# Altium schematic sheet TOP24x_24V_FLYBACK.SchDoc
size A4
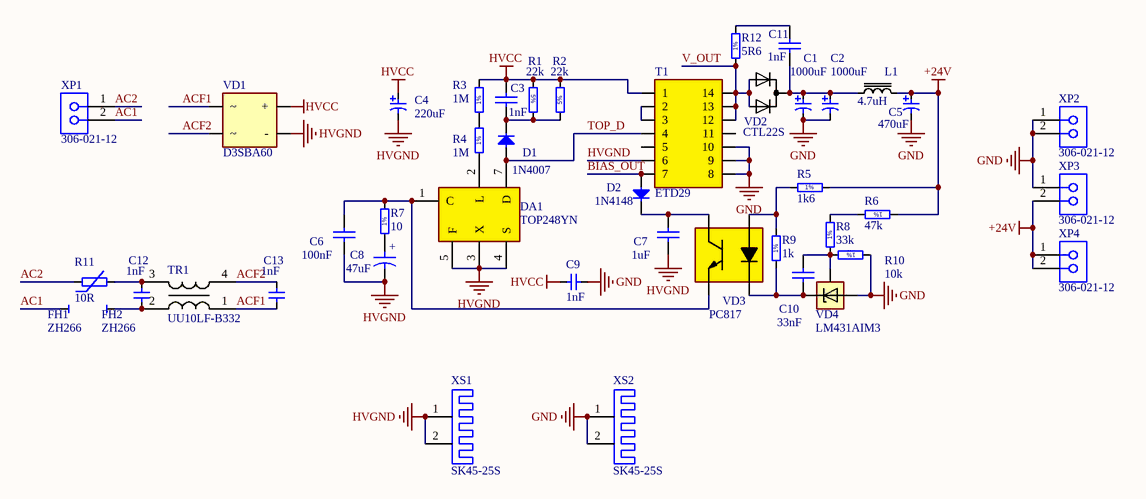
[diagram p0: TOP24x_24V_FLYBACK.SchDoc]

## Parts
C1  1000uF  [CAP_EL_13_20_VERT]
C2  1000uF  [CAP_EL_13_20_VERT]
C3  1nF  [CAPR500-250X720X650]
C4  220uF  [CAP_EL_25_40_VERT]
C5  470uF  [CAP_EL_10_19_VERT]
C6  100nF  [CAPRR508-350X500X500]
C7  1uF  [CAPRR508-508X762X914]
C8  47uF  [CAPPR350-800X1150]
C9  1nF  [CAP_7.5MM_Y]
C10  33nF  [CAPRR254-318X508X660]
C11  1nF  [CAPR500-250X720X650]
C12  1nF  [CAP_7.5MM_Y]
C13  1nF  [CAP_7.5MM_Y]
D1  1N4007  [DO-41]
D2  1N4148  [DO-35]
DA1  TOP248YN  [TO-220-7]
FH1  ZH266  [ZH266]
FH2  ZH266  [ZH266]
L1  4.7uH  [SL1016]
R1  22k  [RESADV508-1670X520]
R2  22k  [RESADV508-1670X520]
R3  1M  [RES_AXIAL_0_25_8]
R4  1M  [RES_AXIAL_0_25_8]
R5  1k6  [RES_AXIAL_0_25_8]
R6  47k  [RES_AXIAL_0_25_8]
R7  10  [RES_AXIAL_0_25_8]
R8  33k  [RES_AXIAL_0_25_8]
R9  1k  [RES_AXIAL_0_25_8]
R10  10k  [RES_AXIAL_0_25_8]
R11  10R  [B57164K]
R12  5R6  [RES_AXIAL_0_25_8]
T1  ETD29  [ETD29]
TR1  PartNumber: UU10LF-B332  [CG00008A]  (hidden comment: 22mH)
VD1  D3SBA60  [D3SBAXX]
VD2  CTL22S  [TO-220-3]
VD3  PC817  [DIP4]
VD4  LM431AIM3  [TO92]
XP1  306-021-12  [306-021-12]
XP2  306-021-12  [306-021-12]
XP3  306-021-12  [306-021-12]
XP4  306-021-12  [306-021-12]
XS1  SK45-25S  [SK45-25S]
XS2  SK45-25S  [SK45-25S]

## Nets
+24V: C5.1 L1.2 R5.2 R6.1 XP3.2 XP4.1 XP4.2
GND: C1.2 C2.2 C5.2 C9.2 R10.1 T1.8 T1.9 T1.10 VD4.2(A) XP2.1 XP2.2 XP3.1 XS2.1(PIN) XS2.2(PIN)
HVCC: C3.2 C4.1 C9.1 R1.1 R2.2 R3.2 T1.1 VD1.P(+)
HVGND: C4.2 C6.2 C7.1 C8.2 DA1.3(X) DA1.4(S) DA1.5(F) T1.6 VD1.N(-) XS1.1(PIN) XS1.2(PIN)
AC1: FH1.1 XP1.2
AC2: R11.1 XP1.1
ACF1: C13.1 TR1.1 VD1.AC1
ACF2: C13.2 TR1.4 VD1.AC2
BIAS_OUT: D2.2(A) T1.7
TOP_D: D1.2(A) DA1.7(D) T1.4
V_OUT: R12.1 T1.12 T1.13 T1.14 VD2.1(A) VD2.3(A)
NetC1_1: C1.1 C2.1 C11.1 L1.1 VD2.2(K)
NetC3_1: C3.1 D1.1(C) R1.2 R2.1
NetC6_1: C6.1 DA1.1(C) R7.2 VD3.3(E)
NetC7_2: C7.2 D2.1(C) VD3.4(C)
NetC8_1: C8.1 R7.1
NetC10_1: C10.1 R8.1 R10.2 VD4.3(REF)
NetC10_2: C10.2 R9.1 VD3.2(K) VD4.1(K)
NetC11_2: C11.2 R12.2
NetC12_1: C12.1 FH2.1 TR1.2
NetC12_2: C12.2 R11.2 TR1.3
NetDA1_2: DA1.2(L) R4.1
NetR3_1: R3.1 R4.2
NetR5_1: R5.1 R9.2 VD3.1(A)
NetR6_2: R6.2 R8.2
NetT1_2: T1.2 T1.3

Not connected (* = marked no-connect by the designer): T1 5 11

## Notes on the sheet
- (in symbol CAER_47UF_63V_20%_350-800X1150) +
- (in symbol RMF_1K6_1%_0.6W_50PPM_1016-630X250) 1%
- (in symbol RMF_1K_1%_0.6W_50PPM_1016-630X250) 1%
- (in symbol RMF_1M_1%_0.6W_50PPM_1016-630X250) 1%
- (in symbol RMF_5R6_1%_0.6W_50PPM_1016-630X250) 1%
- (in symbol RMF_10K_1%_0.6W_50PPM_1016-630X250) 1%
- (in symbol RMF_10R_1%_0.6W_50PPM_1016-630X250) 1%
- (in symbol RMF_22K_5%_3W_250PPM_508-1670X520_v) 5%
- (in symbol RMF_33K_1%_0.6W_50PPM_1016-630X250) 1%
- (in symbol RMF_47K_1%_0.6W_50PPM_1016-630X250) 1%

## Library data of the parts
C1 C2 = SK035M1000B5S-1320 (VERT MOUNTED): Voltage: 35V; Table: Electrolytic THD; Part Number: SK035M1000B5S-1320 (VERT MOUNTED); Value: 1000uF
C3 C11 = CPER_1NF_63V_10%_500-250X720X650: Non-polarised capacitor; Part Description: Metallized Polyester Film Capacitor (MKT); Manufacturer: EPCOS; Manufacturer Part Number: B32529C0102K000; Voltage: 63VDC/40VAC; Tolerance: ±10%; Table: Capacitors THD; Part Number: CPER_1NF_63V_10%_500-250X720X650; Component Kind: Standard; Component Type: Standard; Pin Count: 2; Value: 1nF; Status: None; Case: LS5 W2.5 x L7.2 x H6.5; Mounted: Yes; Socket: No; SMD: No; ComponentHeight: 6.5mm; HelpURL: \\cern.ch\dfs\Applications\Altium\Datasheets\CPER_EPCOS_B32529.pdf; Author: CERN DEM JLC; CreateDate: 19.12.2007; LatestRevisionDate: 19.12.2007
C4 = LG400M0220BPF-2540 (VERT MOUNTED): Voltage: 400V; Table: Electrolytic THD; Part Number: LG400M0220BPF-2540 (VERT MOUNTED); Value: 220uF
C5 = SH050M0470B5S-1019 (VERT MOUNTED): Voltage: 50V; Table: Electrolytic THD; Part Number: SH050M0470B5S-1019 (VERT MOUNTED); Value: 470uF
C6 = CCR_100NF_50V_10%_X7R_508-350X500X500: Non-polarised capacitor; Part Description: Radial Lead Type Monolithic Ceramic Capacitor; Manufacturer: MURATA; Manufacturer Part Number: RPER71H104K2M1A03A; Voltage: 50VDC; TC: X7R; Tolerance: ±10%; Table: Capacitors THD; Part Number: CCR_100NF_50V_10%_X7R_508-350X500X500; Component Kind: Standard; Component Type: Standard; Pin Count: 2; Value: 100nF; Status: Preferred; Case: LS5.08 W3.5 x L5 x H5; Mounted: Yes; Socket: No; SMD: No; ComponentHeight: 5.0mm; HelpURL: \\cern.ch\dfs\Applications\Altium\Datasheets\CCR_MURATA_RPE.pdf; Author: CERN DEM JLC; CreateDate: 28.01.2008; LatestRevisionDate: 24.08.2009
C7 = CCR_1UF_50V_10%_X7R_508-508X762X914: Non-polarised capacitor; Part Description: Radial Lead Type Multilayer Ceramic Capacitor; Manufacturer: KEMET; Manufacturer Part Number: C330C105K5R5TA; Voltage: 50VDC; TC: X7R; Tolerance: ±10%; Table: Capacitors THD; Part Number: CCR_1UF_50V_10%_X7R_508-508X762X914; Component Kind: Standard; Component Type: Standard; Pin Count: 2; Value: 1uF; Status: Preferred; Case: LS5.08 W5.08 x L7.62 x H9.14; Mounted: Yes; Socket: No; SMD: No; ComponentHeight: 9.14mm; HelpURL: \\cern.ch\dfs\Applications\Altium\Datasheets\CCR_KEMET_C330.pdf; Author: CERN DEM JLC; CreateDate: 28.01.2008; LatestRevisionDate: 28.01.2008
C8 = CAER_47UF_63V_20%_350-800X1150: Polarised capacitor; Part Description: Aluminum Electrolytic Capacitor; Manufacturer: GENERIC; Manufacturer1 Part Number: EEUFC1J470; Voltage: 63V; Tolerance: ±20%; Table: Capacitors THD; Part Number: CAER_47UF_63V_20%_350-800X1150; Component Kind: Standard; Component Type: Standard; Pin Count: 2; Value: 47uF; Status: Preferred; Manufacturer Part Number: CAER_47UF_63V_20%_350-800X1150; Case: LS3.5 D8 x H11.5; Mounted: Yes; Socket: No; SMD: No; ComponentHeight: 11.5mm; Manufacturer1 Example: PANASONIC; Manufacturer1 ComponentHeight: 11.5mm; HelpURL: \\cern.ch\dfs\Applications\Altium\Datasheets\CAER_PANASONIC_FC.pdf; Author: CERN DEM JLC; CreateDate: 18.12.2007; LatestRevisionDate: 18.12.2007
C9 C12 C13 = VKO102KCQTC0KR: SMD 0805 Capacitor; Voltage: 1000V; Tolerance: ±10%; Table: Ceramic THD; Part Number: VKO102KCQTC0KR; Value: 1nF
C10 = CCR_33NF_100V_10%_X7R_254-318X508X660: Non-polarised capacitor; Part Description: Radial Lead Type Multilayer Ceramic Capacitor; Manufacturer: GENERIC; Manufacturer1 Part Number: SR201C333KTR; Voltage: 100VDC; TC: X7R; Tolerance: ±10%; Table: Capacitors THD; Part Number: CCR_33NF_100V_10%_X7R_254-318X508X660; Component Kind: Standard; Component Type: Standard; Pin Count: 2; Value: 33nF; Status: Preferred; Manufacturer Part Number: CCR_33NF_100V_10%_X7R_254-318X508X660; Case: LS2.54 W3.18 x L5.08 x H6.6; Mounted: Yes; Socket: No; SMD: No; ComponentHeight: 6.6mm; Manufacturer1 Example: AVX; Manufacturer1 ComponentHeight: 6.6mm; HelpURL: \\cern.ch\dfs\Applications\Altium\Datasheets\CCR_AVX_SR20.pdf; Author: CERN DEM JLC; CreateDate: 30.01.2008; LatestRevisionDate: 24.08.2009
D1 = 1N4007: Diode; Part Description: Axial Lead Standard Recovery Rectifier; Manufacturer: FAIRCHILD SEMICONDUCTOR; Voltage: 1000V; Power: 1A; Table: Diodes; Part Number: 1N4007; Component Kind: Standard; Component Type: Standard; Device: 1N4007; PackageDescription: DO-41, Diode, Axial, Body 4.7 x 2.7mm (LxDia. Max), Pin spacing 10.16mm; Manufacturer Part Number: 1N4007; Pin Count: 2; Case: DO-41; Mounted: Yes; Socket: No; SMD: No; ComponentHeight: 2.72mm; HelpURL: \\cern.ch\dfs\Applications\Altium\Datasheets\1N4007.pdf; ComponentLink1URL: \\cern.ch\dfs\Applications\Altium\Datasheets\1N4007_Package.pdf; ComponentLink1Description: Package Drawing; Author: CERN DEM JLC; CreateDate: 20.08.2008; LatestRevisionDate: 30.10.2013
D2 = 1N4148: Diode; Part Description: High-Speed Diode; Manufacturer: NXP SEMICONDUCTORS; Voltage: 100V; Power: 200mA; Table: Diodes; Part Number: 1N4148; Component Kind: Standard; Component Type: Standard; Device: 1N4148; PackageDescription: DO-35, Diode, Axial, Body 4.6 x 2mm (LxDia. max), Pin spacing 7.62mm; Manufacturer Part Number: 1N4148; Pin Count: 2; Case: DO-35; Mounted: Yes; Socket: No; SMD: No; ComponentHeight: 1.85mm; HelpURL: \\cern.ch\dfs\Applications\Altium\Datasheets\1N4148.pdf; Author: CERN DEM JLC; CreateDate: 24.05.2012; LatestRevisionDate: 24.05.2012
DA1 = TOP248YN: Table: Power; Part Number: TOP248YN; Device: TOP248YN
FH1 FH2 = ZH266: Table: OTHER; Part Number: ZH266; Family: ZH266; Device: ZH266
L1 = SL1016T-4R7K-B-N: Table: Inductors THD; Tolerance: ± 10%; Part Number: SL1016T-4R7K-B-N; Value: 4.7uH
R1 R2 = RMF_22K_5%_3W_250PPM_508-1670X520_v: Resistor - 5%; Part Description: Leaded Power Metal Film Resistor (Vertical Mount) PR03 Series; Manufacturer: GENERIC; Manufacturer1 Part Number: PR03000202202JAC00; Power: 3W; TC: ±250ppm/°C; Table: Resistors THD; Part Number: RMF_22K_5%_3W_250PPM_508-1670X520_v; Component Kind: Standard; Component Type: Standard; Pin Count: 2; Value: 22k; Status: Preferred; Tolerance: ±5%; Manufacturer Part Number: RMF_22K_5%_3W_250PPM_508-1670X520; Case: LS5.08 L16.7 x D5.2; Mounted: Yes; Socket: No; SMD: No; ComponentHeight: 23.6mm; Manufacturer1 Example: VISHAY BCCOMPONENT; Manufacturer1 ComponentHeight: 23.6mm; HelpURL: \\cern.ch\dfs\Applications\Altium\Datasheets\RMF_VISHAY_PR03.pdf; Author: CERN DEM JLC; CreateDate: 18.11.2011; LatestRevisionDate: 01.10.2012
R3 R4 = RMF_1M_1%_0.6W_50PPM_1016-630X250: Part Description: Leaded Metal Film Resistor; Manufacturer: GENERIC; Manufacturer1 Part Number: MBB02070C1004FCT00; Power: 0.6W; TC: ±50ppm/°C; Tolerance: ±1%; Table: THD; Part Number: RMF_1M_1%_0.6W_50PPM_1016-630X250; Component Kind: Standard; Component Type: Standard; Pin Count: 2; Value: 1M; Status: Preferred; Manufacturer Part Number: RMF_1M_1%_0.6W_50PPM_1016-630X250; Case: LS10.16 L6.3 x D2.5; Mounted: Yes; Socket: No; SMD: No; ComponentHeight: 2.5mm; Manufacturer1 Example: VISHAY BEYSCHLAG; Manufacturer1 ComponentHeight: 2.5mm; HelpURL: \\cern.ch\dfs\Applications\Altium\Datasheets\RMF_VISHAY_MBB0207.pdf; Author: CERN DEM JLC; CreateDate: 04.12.2007; LatestRevisionDate: 07.04.2008
R5 = RMF_1K6_1%_0.6W_50PPM_1016-630X250: Part Description: Leaded Metal Film Resistor; Manufacturer: GENERIC; Manufacturer1 Part Number: MBB02070C1601FCT00; Power: 0.6W; TC: ±50ppm/°C; Tolerance: ±1%; Table: THD; Part Number: RMF_1K6_1%_0.6W_50PPM_1016-630X250; Component Kind: Standard; Component Type: Standard; Pin Count: 2; Value: 1k6; Status: Preferred; Manufacturer Part Number: RMF_1K6_1%_0.6W_50PPM_1016-630X250; Case: LS10.16 L6.3 x D2.5; Mounted: Yes; Socket: No; SMD: No; ComponentHeight: 2.5mm; Manufacturer1 Example: VISHAY BEYSCHLAG; Manufacturer1 ComponentHeight: 2.5mm; HelpURL: \\cern.ch\dfs\Applications\Altium\Datasheets\RMF_VISHAY_MBB0207.pdf; Author: CERN DEM JLC; CreateDate: 04.12.2007; LatestRevisionDate: 07.04.2008
R6 = RMF_47K_1%_0.6W_50PPM_1016-630X250: Part Description: Leaded Metal Film Resistor; Manufacturer: GENERIC; Manufacturer1 Part Number: MBB02070C4702FCT00; Power: 0.6W; TC: ±50ppm/°C; Tolerance: ±1%; Table: THD; Part Number: RMF_47K_1%_0.6W_50PPM_1016-630X250; Component Kind: Standard; Component Type: Standard; Pin Count: 2; Value: 47k; Status: Preferred; Manufacturer Part Number: RMF_47K_1%_0.6W_50PPM_1016-630X250; Case: LS10.16 L6.3 x D2.5; Mounted: Yes; Socket: No; SMD: No; ComponentHeight: 2.5mm; Manufacturer1 Example: VISHAY BEYSCHLAG; Manufacturer1 ComponentHeight: 2.5mm; HelpURL: \\cern.ch\dfs\Applications\Altium\Datasheets\RMF_VISHAY_MBB0207.pdf; Author: CERN DEM JLC; CreateDate: 04.12.2007; LatestRevisionDate: 07.04.2008
R7 = RMF_10R_1%_0.6W_50PPM_1016-630X250: Part Description: Leaded Metal Film Resistor; Manufacturer: GENERIC; Manufacturer1 Part Number: MBB02070C1009FCT00; Power: 0.6W; TC: ±50ppm/°C; Tolerance: ±1%; Table: Resistors THD; Part Number: RMF_10R_1%_0.6W_50PPM_1016-630X250; Component Kind: Standard; Component Type: Standard; Pin Count: 2; Value: 10; Status: Preferred; Manufacturer Part Number: RMF_10R_1%_0.6W_50PPM_1016-630X250; Case: LS10.16 L6.3 x D2.5; Mounted: Yes; Socket: No; SMD: No; ComponentHeight: 2.5mm; Manufacturer1 Example: VISHAY BEYSCHLAG; Manufacturer1 ComponentHeight: 2.5mm; HelpURL: \\cern.ch\dfs\Applications\Altium\Datasheets\RMF_VISHAY_MBB0207.pdf; Author: CERN DEM JLC; CreateDate: 04.12.2007; LatestRevisionDate: 07.04.2008
R8 = RMF_33K_1%_0.6W_50PPM_1016-630X250: Part Description: Leaded Metal Film Resistor; Manufacturer: GENERIC; Manufacturer1 Part Number: MBB02070C3302FCT00; Power: 0.6W; TC: ±50ppm/°C; Tolerance: ±1%; Table: THD; Part Number: RMF_33K_1%_0.6W_50PPM_1016-630X250; Component Kind: Standard; Component Type: Standard; Pin Count: 2; Value: 33k; Status: Preferred; Manufacturer Part Number: RMF_33K_1%_0.6W_50PPM_1016-630X250; Case: LS10.16 L6.3 x D2.5; Mounted: Yes; Socket: No; SMD: No; ComponentHeight: 2.5mm; Manufacturer1 Example: VISHAY BEYSCHLAG; Manufacturer1 ComponentHeight: 2.5mm; HelpURL: \\cern.ch\dfs\Applications\Altium\Datasheets\RMF_VISHAY_MBB0207.pdf; Author: CERN DEM JLC; CreateDate: 04.12.2007; LatestRevisionDate: 07.04.2008
R9 = RMF_1K_1%_0.6W_50PPM_1016-630X250: Part Description: Leaded Metal Film Resistor; Manufacturer: GENERIC; Manufacturer1 Part Number: MBB02070C1001FCT00; Power: 0.6W; TC: ±50ppm/°C; Tolerance: ±1%; Table: THD; Part Number: RMF_1K_1%_0.6W_50PPM_1016-630X250; Component Kind: Standard; Component Type: Standard; Pin Count: 2; Value: 1k; Status: Preferred; Manufacturer Part Number: RMF_1K_1%_0.6W_50PPM_1016-630X250; Case: LS10.16 L6.3 x D2.5; Mounted: Yes; Socket: No; SMD: No; ComponentHeight: 2.5mm; Manufacturer1 Example: VISHAY BEYSCHLAG; Manufacturer1 ComponentHeight: 2.5mm; HelpURL: \\cern.ch\dfs\Applications\Altium\Datasheets\RMF_VISHAY_MBB0207.pdf; Author: CERN DEM JLC; CreateDate: 04.12.2007; LatestRevisionDate: 07.04.2008
R10 = RMF_10K_1%_0.6W_50PPM_1016-630X250: Part Description: Leaded Metal Film Resistor; Manufacturer: GENERIC; Manufacturer1 Part Number: MBB02070C1002FCT00; Power: 0.6W; TC: ±50ppm/°C; Tolerance: ±1%; Table: THD; Part Number: RMF_10K_1%_0.6W_50PPM_1016-630X250; Component Kind: Standard; Component Type: Standard; Pin Count: 2; Value: 10k; Status: Preferred; Manufacturer Part Number: RMF_10K_1%_0.6W_50PPM_1016-630X250; Case: LS10.16 L6.3 x D2.5; Mounted: Yes; Socket: No; SMD: No; ComponentHeight: 2.5mm; Manufacturer1 Example: VISHAY BEYSCHLAG; Manufacturer1 ComponentHeight: 2.5mm; HelpURL: \\cern.ch\dfs\Applications\Altium\Datasheets\RMF_VISHAY_MBB0207.pdf; Author: CERN DEM JLC; CreateDate: 04.12.2007; LatestRevisionDate: 07.04.2008
R11 = B57164K: Table: NTC; Part Number: B57164K; Value: 10R
R12 = RMF_5R6_1%_0.6W_50PPM_1016-630X250: Part Description: Leaded Metal Film Resistor; Manufacturer: GENERIC; Manufacturer1 Part Number: MBB02070C5608FCT00; Power: 0.6W; TC: ±50ppm/°C; Tolerance: ±1%; Table: THD; Part Number: RMF_5R6_1%_0.6W_50PPM_1016-630X250; Component Kind: Standard; Component Type: Standard; Pin Count: 2; Value: 5R6; Status: Not recommended; Manufacturer Part Number: RMF_5R6_1%_0.6W_50PPM_1016-630X250; Case: LS10.16 L6.3 x D2.5; Mounted: Yes; Socket: No; SMD: No; ComponentHeight: 2.5mm; Manufacturer1 Example: VISHAY BEYSCHLAG; Manufacturer1 ComponentHeight: 2.5mm; HelpURL: \\cern.ch\dfs\Applications\Altium\Datasheets\RMF_VISHAY_MBB0207.pdf; Author: CERN DEM JLC; CreateDate: 04.12.2007; LatestRevisionDate: 07.04.2008
T1 = ETD29: Table: Cores; Part Number: ETD29; Value: ETD29
TR1 = CG00008A: Table: Inductors THD; Part Number: CG00008A; Value: 22mH
VD1 = D3SBA60: Table: Diode; Part Number: D3SBA60; Device: D3SBA60
VD2 = CTL22S: Table: Diode; Part Number: CTL22S; Device: CTL22S
VD3 = PC817: Table: Optocouplers; Part Number: PC817; Device: PC817
VD4 = LM431AIM3: Table: Diode; Part Number: LM431AIM3; Device: LM431AIM3
XP1-XP4 = 306-021-12: Table: DEGSON; Part Number: 306-021-12; Family: DG306; Device: 306-021-12
XS1 XS2 = SK45-25S: Part Description: SMD Antenne WE-MCA; Manufacturer: Wurth Elektronik; Manufacturer Part Number: 7488910245; Table: Mechanics; Part Number: SK45-25S; Component Kind: Standard; Component Type: Standard; Device: SK45-25S; Footprint: 7488910245; Pin Count: 2; Case: 7488910245; Socket: No; SMD: Yes; ComponentHeight: 3.68; Author: I. Kuznetsov